# Altium schematic sheet Sheet5.SchDoc
size 420 x 297 mm; CheckedBy: Бондарчук ПС; Author: Ільницька ЛЛ; CompanyName: ТОВ "Радіонікс"; SheetNumber: 1; SheetTotal: 1; PageSetup: Record=PageOptions|CenterHorizontal=True|CenterVertical=True|PrintScale=0.66|XCorrection=1.00|YCorrection=1.00|PrintKind=1|BorderSize=5000000|LeftOffset=0|BottomOffset=0|Orientation=2|PaperLength=2970|PaperWidth=2100|Scale=100|PaperSource=7|PrintQuality=600|MediaType=1|DitherType=10|PrintScaleMode=1|PaperKind=A4|PaperIndex=9; DecimalNumber: АЧАД.441465.ххх Э3; HeadOfSector: Нач. сектора; MainDevice: Перв.примен.; Name: СТЕНД КОНТРОЛЯ ПРИВОДА; DecimalNumber_MIRROR: ххх.564144.ДАЧА
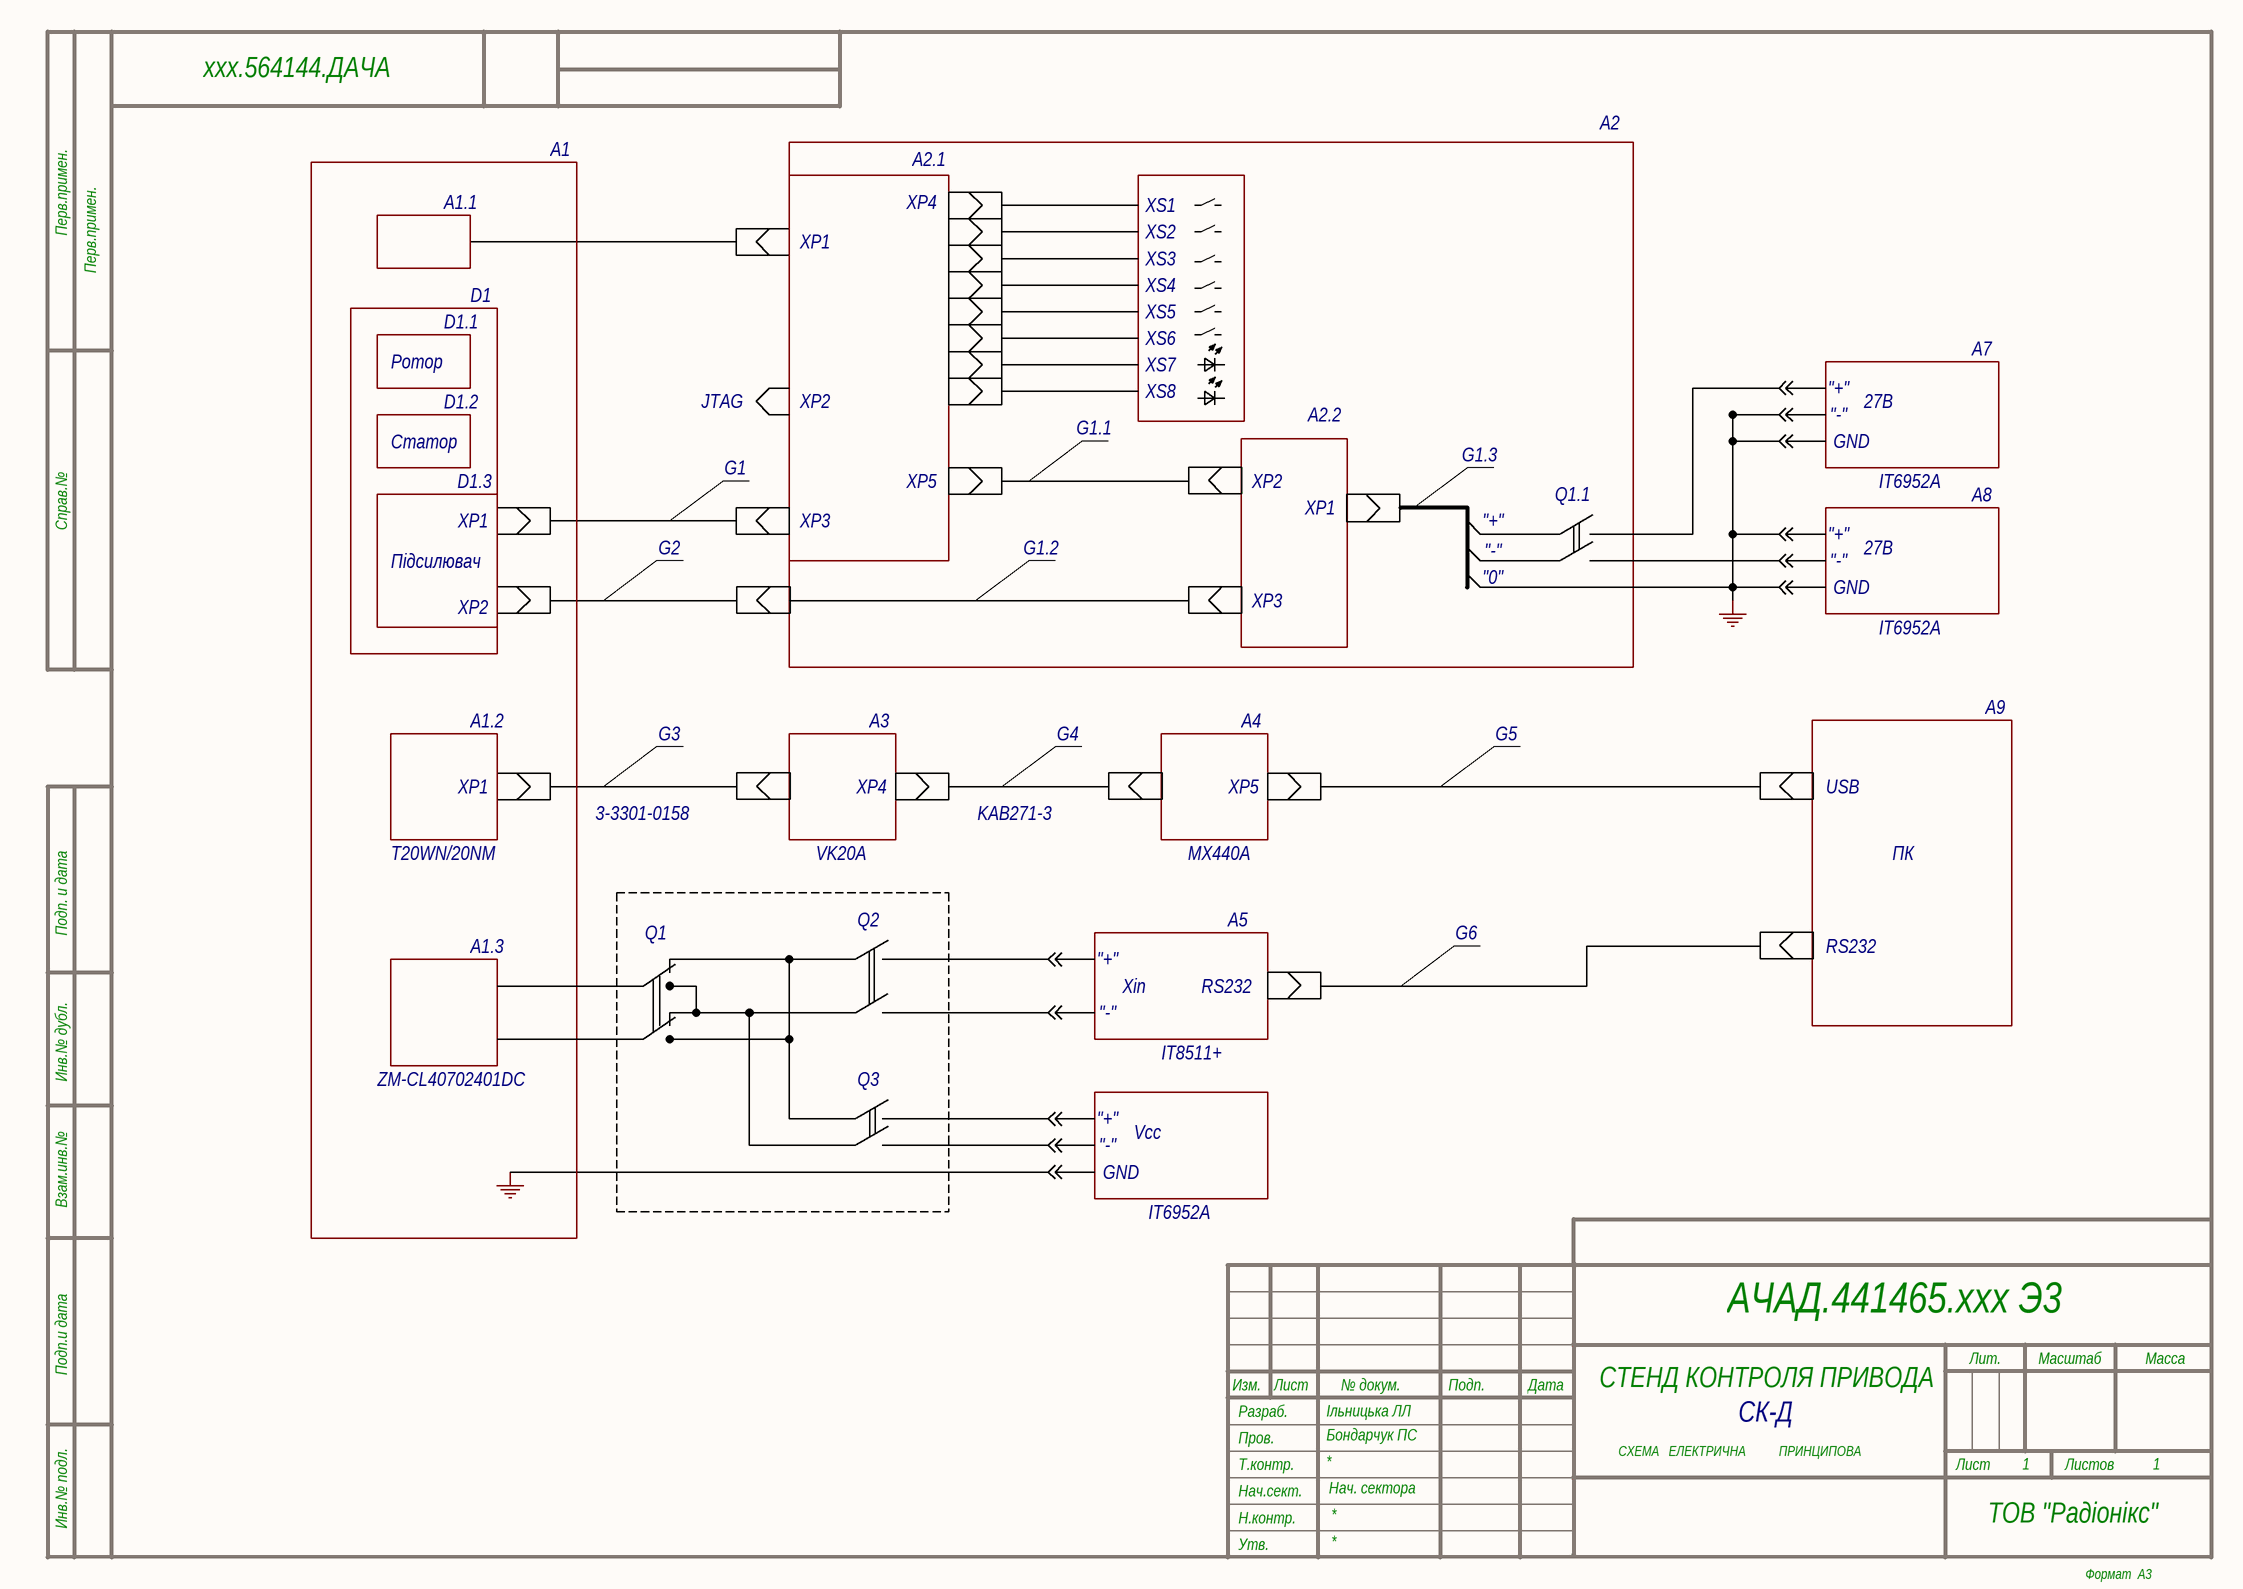
[diagram p0: Sheet5.SchDoc]

## Notes on the sheet
- А1
- А2.1
- А2
- А1.1
- XP1
- XP4
- XS1
- XS2
- XS3
- D1.1
- D1
- XS4
- XS5
- Ротор
- JTAG
- XP2
- XS6
- XS7
- XS8
- "+"
- 27В
- А7
- Статор
- D1.2
- G1
- G1.1
- А2.2
- G1.3
- "-"
- GND
- D1.3
- XP3
- XP5
- Q1.1
- IT6952A
- А8
- Підсилювач
- G2
- G1.2
- "0"
- А1.2
- G3
- А3
- G4
- А4
- G5
- А9
- USB
- T20WN/20NM
- 3-3301-0158
- VK20A
- KAB271-3
- MX440A
- ПК
- Q1
- Q2
- А5
- G6
- А1.3
- Xin
- RS232
- IT8511+
- ZM-CL40702401DC
- Q3
- Vcc
- СК-Д
- Labels drawn without touching a wire or pin: GND
- Перв.примен.
- Справ.№
- Подп. и дата
- Инв.№ дубл.
- Взам.инв.№
- Подп.и дата
- Разраб.
- Изм.
- Лист
- № докум.
- Подп.
- Дата
- Лит.
- Масштаб
- Масса
- Т.контр.
- Пров.
- СХЕМА   ЕЛЕКТРИЧНА
- ПРИНЦИПОВА
- Листов
- Инв.№ подл.
- Утв.
- Н.контр.
- Нач.сект.
- Формат  A3